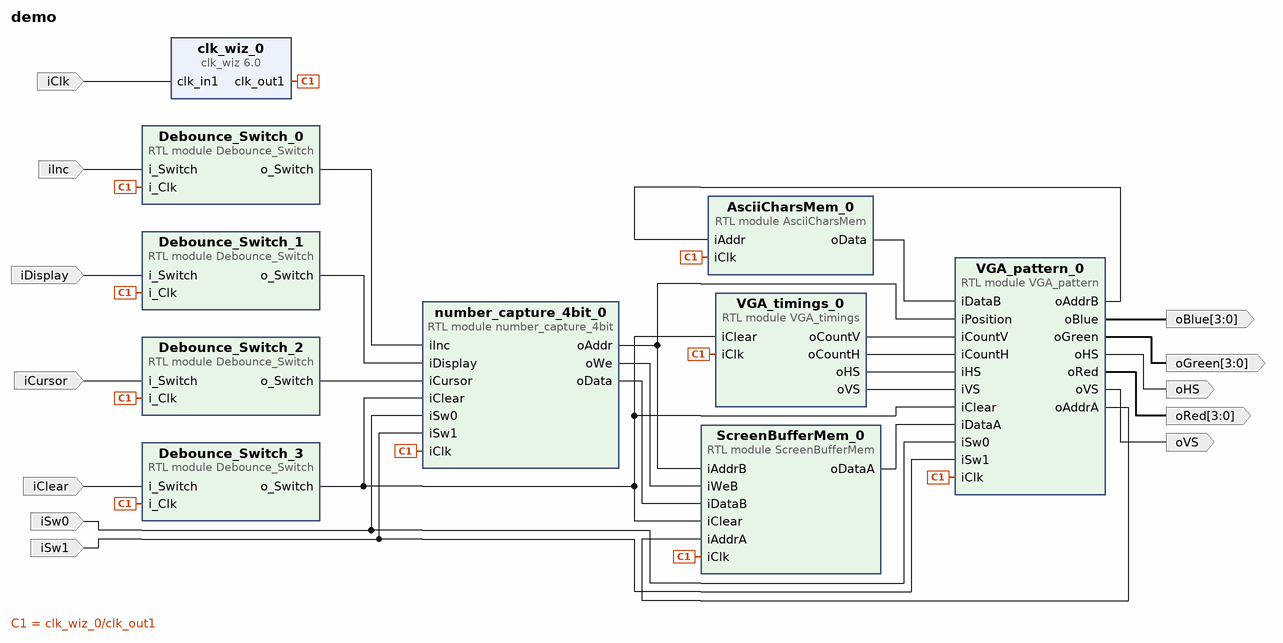
[diagram p0: block diagram of the top level]
# Vivado block design demo, xc7z020clg400-1, Vivado 2020.1
create_bd_design demo

create_bd_port -dir I -type clk iClk
create_bd_port -dir I iInc
create_bd_port -dir I iDisplay
create_bd_port -dir O oHS
create_bd_port -dir O oVS
create_bd_port -dir O -from 3 -to 0 oRed
create_bd_port -dir O -from 3 -to 0 oGreen
create_bd_port -dir O -from 3 -to 0 oBlue
create_bd_port -dir I iSw0
create_bd_port -dir I iSw1
create_bd_port -dir I iClear
create_bd_port -dir I iCursor

create_bd_cell -type module -reference AsciiCharsMem AsciiCharsMem_0
create_bd_cell -type ip -vlnv xilinx.com:ip:clk_wiz:6.0 clk_wiz_0
set_property -dict [list \
  CONFIG.CLKIN1_JITTER_PS 80.0 \
  CONFIG.CLKOUT1_JITTER 312.659 \
  CONFIG.CLKOUT1_PHASE_ERROR 245.713 \
  CONFIG.CLKOUT1_REQUESTED_OUT_FREQ 25 \
  CONFIG.CLK_IN1_BOARD_INTERFACE sys_clock \
  CONFIG.MMCM_CLKFBOUT_MULT_F 36.500 \
  CONFIG.MMCM_CLKIN1_PERIOD 8.000 \
  CONFIG.MMCM_CLKOUT0_DIVIDE_F 36.500 \
  CONFIG.MMCM_DIVCLK_DIVIDE 5 \
  CONFIG.USE_LOCKED false \
  CONFIG.USE_RESET false \
] [get_bd_cells clk_wiz_0]
create_bd_cell -type module -reference VGA_timings VGA_timings_0
create_bd_cell -type module -reference ScreenBufferMem ScreenBufferMem_0
create_bd_cell -type module -reference VGA_pattern VGA_pattern_0
create_bd_cell -type module -reference number_capture_4bit number_capture_4bit_0
create_bd_cell -type module -reference Debounce_Switch Debounce_Switch_0
create_bd_cell -type module -reference Debounce_Switch Debounce_Switch_1
create_bd_cell -type module -reference Debounce_Switch Debounce_Switch_2
create_bd_cell -type module -reference Debounce_Switch Debounce_Switch_3

# ---- connections ----

connect_bd_net [get_bd_pins VGA_pattern_0/oAddrB] [get_bd_pins AsciiCharsMem_0/iAddr]
connect_bd_net [get_bd_pins AsciiCharsMem_0/oData] [get_bd_pins VGA_pattern_0/iDataB]
connect_bd_net [get_bd_pins number_capture_4bit_0/oWe] [get_bd_pins ScreenBufferMem_0/iWeB]
connect_bd_net [get_bd_pins number_capture_4bit_0/oData] [get_bd_pins ScreenBufferMem_0/iDataB]
connect_bd_net [get_bd_pins number_capture_4bit_0/oAddr] [get_bd_pins ScreenBufferMem_0/iAddrB] [get_bd_pins VGA_pattern_0/iPosition]
connect_bd_net [get_bd_pins VGA_pattern_0/oAddrA] [get_bd_pins ScreenBufferMem_0/iAddrA]
connect_bd_net -net i_Switch_0_1 [get_bd_ports iInc] [get_bd_pins Debounce_Switch_0/i_Switch]
connect_bd_net -net i_Switch_0_2 [get_bd_ports iDisplay] [get_bd_pins Debounce_Switch_1/i_Switch]
connect_bd_net [get_bd_pins Debounce_Switch_1/o_Switch] [get_bd_pins number_capture_4bit_0/iDisplay]
connect_bd_net [get_bd_ports iClk] [get_bd_pins clk_wiz_0/clk_in1]
connect_bd_net [get_bd_pins clk_wiz_0/clk_out1] \
  [get_bd_pins AsciiCharsMem_0/iClk] [get_bd_pins VGA_timings_0/iClk] [get_bd_pins ScreenBufferMem_0/iClk] \
  [get_bd_pins VGA_pattern_0/iClk] [get_bd_pins number_capture_4bit_0/iClk] [get_bd_pins Debounce_Switch_0/i_Clk] \
  [get_bd_pins Debounce_Switch_1/i_Clk] [get_bd_pins Debounce_Switch_2/i_Clk] [get_bd_pins Debounce_Switch_3/i_Clk]
connect_bd_net [get_bd_pins VGA_timings_0/oCountV] [get_bd_pins VGA_pattern_0/iCountV]
connect_bd_net [get_bd_pins VGA_timings_0/oCountH] [get_bd_pins VGA_pattern_0/iCountH]
connect_bd_net [get_bd_pins VGA_timings_0/oHS] [get_bd_pins VGA_pattern_0/iHS]
connect_bd_net [get_bd_pins VGA_timings_0/oVS] [get_bd_pins VGA_pattern_0/iVS]
connect_bd_net [get_bd_pins ScreenBufferMem_0/oDataA] [get_bd_pins VGA_pattern_0/iDataA]
connect_bd_net [get_bd_pins VGA_pattern_0/oHS] [get_bd_ports oHS]
connect_bd_net [get_bd_pins VGA_pattern_0/oVS] [get_bd_ports oVS]
connect_bd_net [get_bd_pins VGA_pattern_0/oRed] [get_bd_ports oRed]
connect_bd_net [get_bd_pins VGA_pattern_0/oGreen] [get_bd_ports oGreen]
connect_bd_net [get_bd_pins VGA_pattern_0/oBlue] [get_bd_ports oBlue]
connect_bd_net -net iSw0_0_1 [get_bd_ports iSw0] [get_bd_pins VGA_pattern_0/iSw0] [get_bd_pins number_capture_4bit_0/iSw0]
connect_bd_net -net iSw1_0_1 [get_bd_ports iSw1] [get_bd_pins VGA_pattern_0/iSw1] [get_bd_pins number_capture_4bit_0/iSw1]
connect_bd_net [get_bd_pins Debounce_Switch_0/o_Switch] [get_bd_pins number_capture_4bit_0/iInc]
connect_bd_net [get_bd_pins Debounce_Switch_2/o_Switch] [get_bd_pins number_capture_4bit_0/iCursor]
connect_bd_net -net i_Switch_0_3 [get_bd_ports iCursor] [get_bd_pins Debounce_Switch_2/i_Switch]
connect_bd_net [get_bd_ports iClear] [get_bd_pins Debounce_Switch_3/i_Switch]
connect_bd_net [get_bd_pins Debounce_Switch_3/o_Switch] \
  [get_bd_pins VGA_timings_0/iClear] [get_bd_pins ScreenBufferMem_0/iClear] [get_bd_pins VGA_pattern_0/iClear] \
  [get_bd_pins number_capture_4bit_0/iClear]

validate_bd_design
save_bd_design
